# Altium schematic sheet LCD-Touch.SchDoc
size Letter
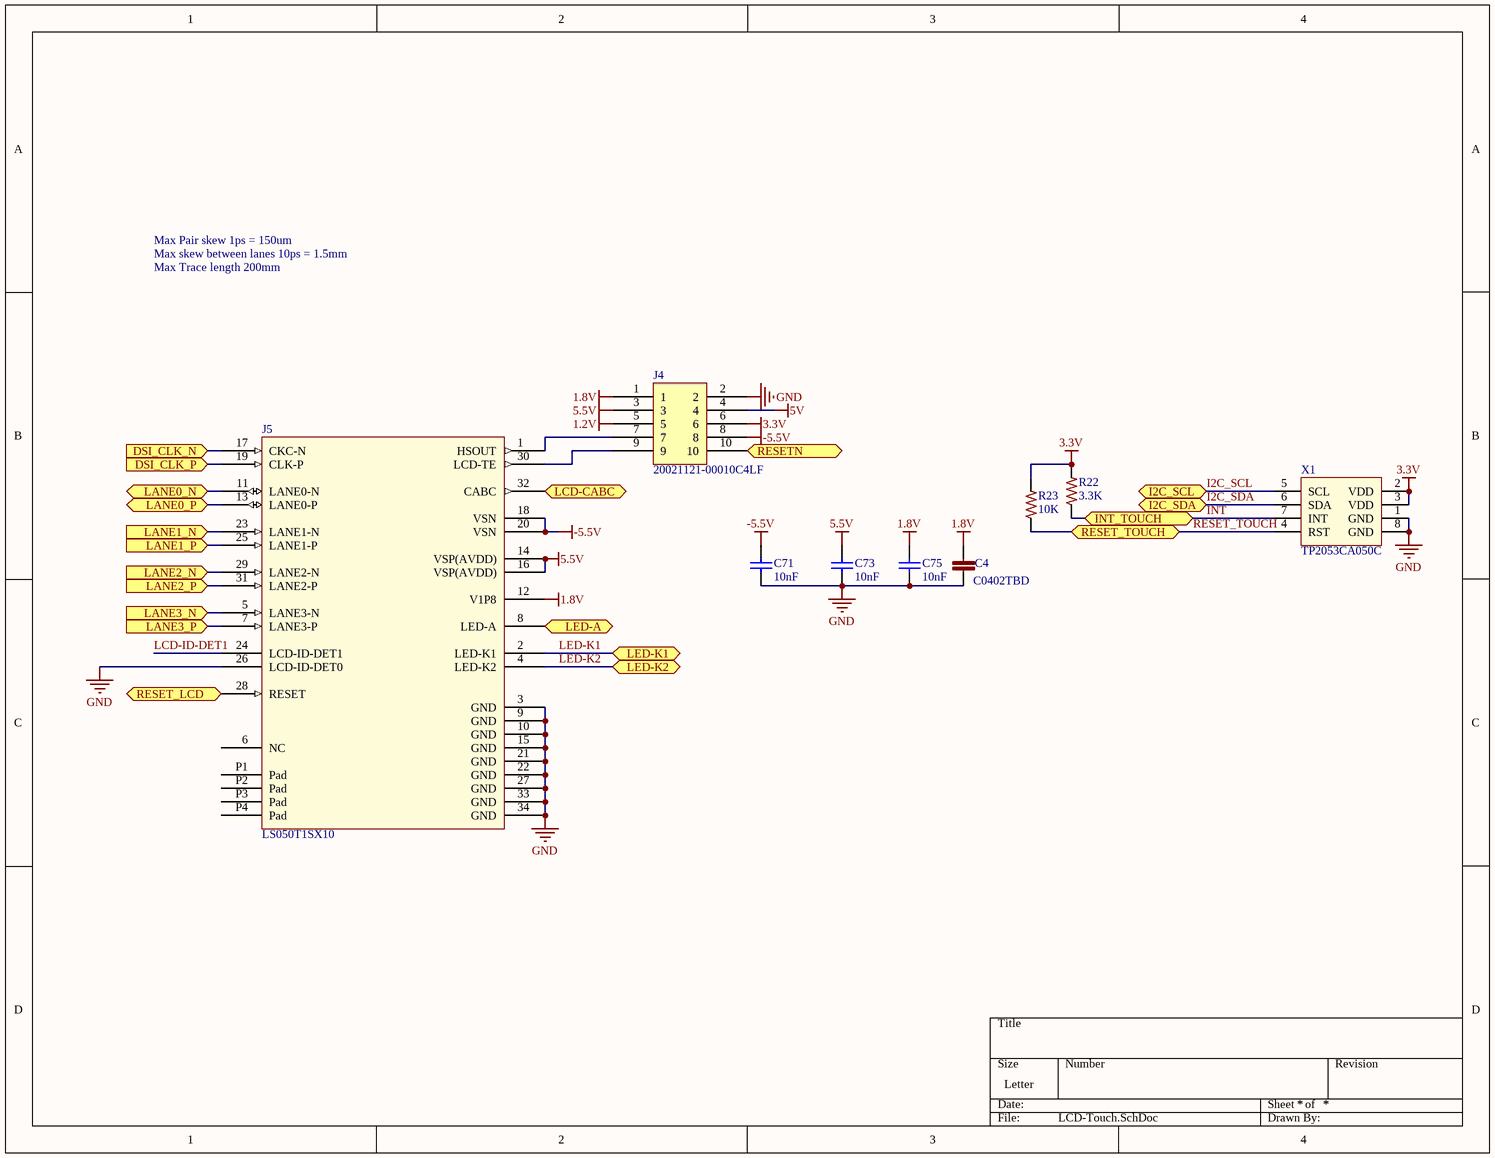
[diagram p0: LCD-Touch.SchDoc]

## Parts
C4  C0402TBD  [C0402]
C71  10nF  [C0402]
C73  10nF  [C0402]
C75  10nF  [C0402]
J4  20021121-00010C4LF  [FTSH-105-XX-X-DV]
J5  LS050T1SX10  [504208-3410]
R22  3.3K  [R0603]
R23  10K  [R0402]
X1  TP2053CA050C  [FFC8x05-top]

## Ports
DSI_CLK_N (in), DSI_CLK_P (in), I2C_SCL, I2C_SDA, INT_TOUCH, LANE0_N (bidir), LANE0_P (bidir), LANE1_N (in), LANE1_P (in), LANE2_N (in), LANE2_P (in), LANE3_N (in), LANE3_P (in), LCD-CABC, LED-A, LED-K1, LED-K2, RESET_LCD, RESET_TOUCH, RESETN

## Nets
1.2V: J4.5
1.8V: C4.1 C75.2 J4.1 J5.12(V1P8)
3.3V: J4.6 R22.2 R23.2 X1.2(VDD) X1.3(VDD)
5.5V: C73.2 J4.3 J5.14(VSP(AVDD)) J5.16(VSP(AVDD))
5V: J4.4
-5.5V: C71.2 J4.8 J5.18(VSN) J5.20(VSN)
GND: C4.2 C71.1 C73.1 C75.1 J4.2 J5.3(GND) J5.9(GND) J5.10(GND) J5.15(GND) J5.21(GND) J5.22(GND) J5.26(LCD-ID-DET0) J5.27(GND) J5.33(GND) J5.34(GND) X1.1(GND) X1.8(GND)
DSI_CLK_N: J5.17(CKC-N) ; port DSI_CLK_N
DSI_CLK_P: J5.19(CLK-P) ; port DSI_CLK_P
I2C_SCL: X1.5(SCL) ; port I2C_SCL
I2C_SDA: X1.6(SDA) ; port I2C_SDA
INT: R22.1 X1.7(INT) ; port INT_TOUCH
LANE0_N: J5.11(LANE0-N) ; port LANE0_N
LANE0_P: J5.13(LANE0-P) ; port LANE0_P
LANE1_N: J5.23(LANE1-N) ; port LANE1_N
LANE1_P: J5.25(LANE1-P) ; port LANE1_P
LANE2_N: J5.29(LANE2-N) ; port LANE2_N
LANE2_P: J5.31(LANE2-P) ; port LANE2_P
LANE3_N: J5.5(LANE3-N) ; port LANE3_N
LANE3_P: J5.7(LANE3-P) ; port LANE3_P
LCD-CABC: J5.32(CABC) ; port LCD-CABC
LCD-ID-DET1: J5.24(LCD-ID-DET1)
LED-A: J5.8(LED-A) ; port LED-A
LED-K1: J5.2(LED-K1) ; port LED-K1
LED-K2: J5.4(LED-K2) ; port LED-K2
RESET_LCD: J5.28(RESET) ; port RESET_LCD
RESET_TOUCH: R23.1 X1.4(RST) ; port RESET_TOUCH
RESETN: J4.10 ; port RESETN
NetJ4_7: J4.7 J5.1(HSOUT)
NetJ4_9: J4.9 J5.30(LCD-TE)

Not connected (* = marked no-connect by the designer): J5 6(NC) P1(Pad) P2(Pad) P3(Pad) P4(Pad)

## Notes on the sheet
- Max Pair skew 1ps = 150um
- Max skew between lanes 10ps = 1.5mm
- Max Trace length 200mm

## Library data of the parts
C4 = C0402TBD: Capacitor Non Polarized; LastRevisionNote: ImportComponents; Published: 23-Apr-2014; Publisher: UltiMachine; VALUE: C0402TBD; LastRevisionDate: 23-Apr-2014
C71 C73 C75 = GRM155R71H103JA88D: CAP CER 10nF 50V X7R 0402; MFR: Murata; Part Description: CAP CER 10000PF 50V X7R 0402; Tolerance: 10%; Voltage: 6.3VDC; Value: 0.01uF 50V; Published: 10 - Dec - 2014; LatestRevisionDate: 10 - Dec - 2014; LatestRevisionNote: Ultimachine Footprint Added; Publisher: Ultimachine; Component Type: Chip Capacitor; MFR Part #: GRM155R71H103JA88D; Mounting Type: SMT 0402; Datasheet: http://search.murata.co.jp/Ceramy/image/img/A01X/G101/ENG/GRM155R71H103JA88-01.pdf; Height: 0.5 ±0.05mm; Digikey #: 490-7763-1-ND; PackageReference: 0402
J4 = ARM Cortex JTAG-DEBUG Header
J5 = LS050T1SX10: 5"HD LCD Module connector
R22 = ERJ-3GEYJ332V: RES 0603 3.3K 100mW 1%; ManufacturerPartNumber: ERJ-3EKF1002V; LastRevisionNote: ImportComponents; Published: 23-Apr-2014; Publisher: UltiMachine; LastRevisionDate: 23-Apr-2014; VALUE: 3.3K
R23 = RC0402FR-0710KP: RES SMD 10K OHM 1% 1/16W 0402; LastRevisionNote: ImportComponents; Published: 23-Apr-2014; Publisher: UltiMachine; LastRevisionDate: 23-Apr-2014; ManufacturerPartNumber: RC0402FR-0710KP; VALUE: 10K
X1 = TP2053CA050C: UltiMachine 5" HD Touch Interface